# EAGLE design powerboard_v1b (EAGLE 7.2.0)
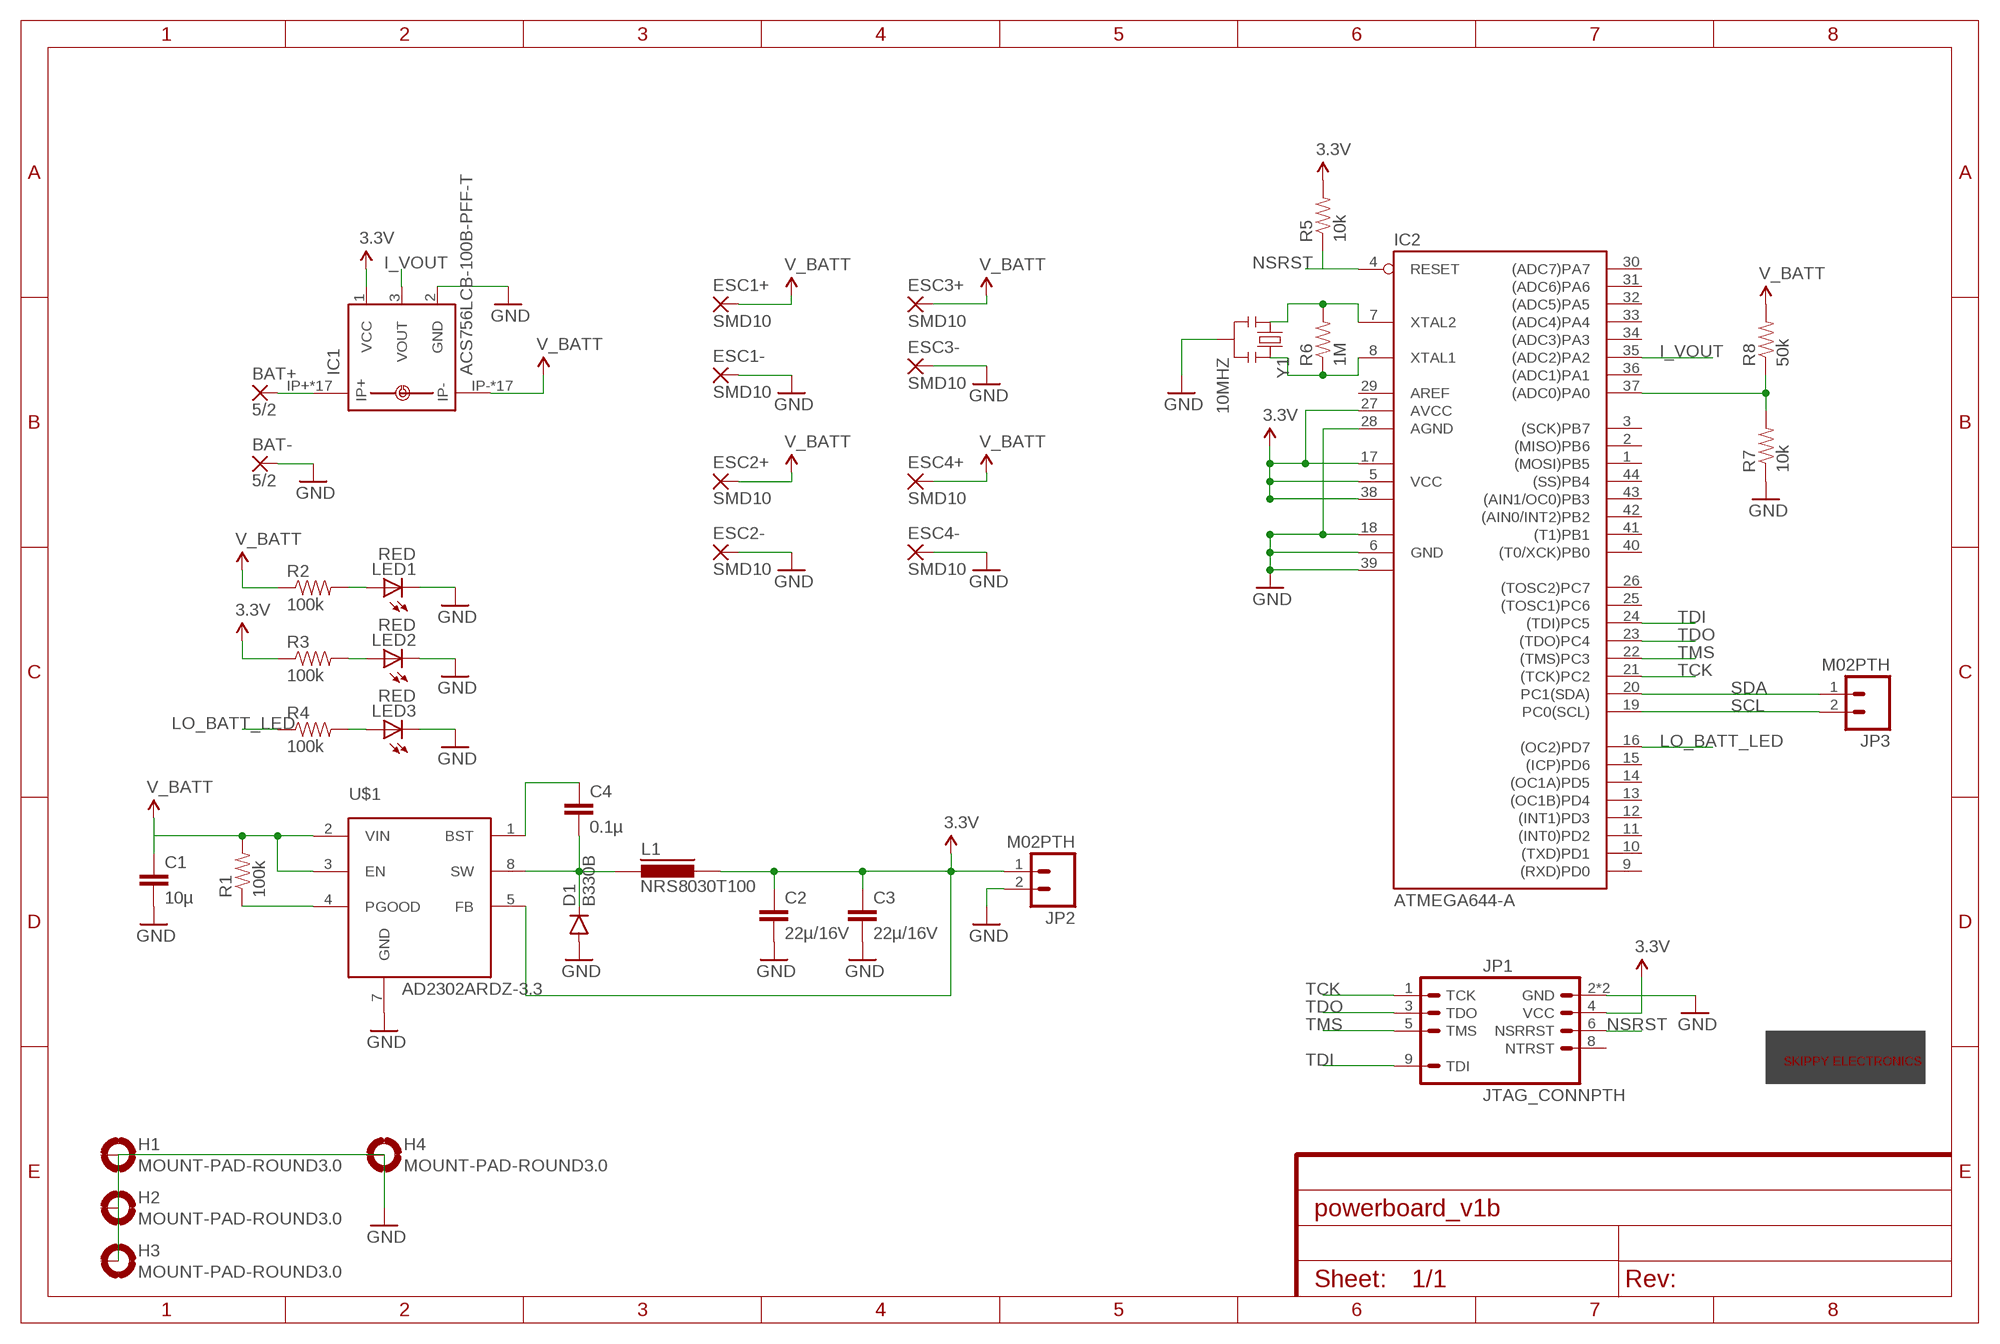
[diagram p0: schematic, sheet 1]
FRAME1 (FRAME-A4L): CNAME: SkippyElectronics; CREVISION: 1.0.0; DESIGNER: Christophe Huriaux

## Parts
BAT+  5/2  [5/2]
BAT-  5/2  [5/2]
C1  10µ  CAP1206  [1206]
C2  22µ/16V  CAP1206  [1206]
C3  22µ/16V  CAP1206  [1206]
C4  0.1µ  CAP1206  [1206]
D1  B330B  DIODESMB  [SMB-DIODE]
ESC1+  SMD10  [SMD5.08-10.16]
ESC1-  SMD10  [SMD5.08-10.16]
ESC2+  SMD10  [SMD5.08-10.16]
ESC2-  SMD10  [SMD5.08-10.16]
ESC3+  SMD10  [SMD5.08-10.16]
ESC3-  SMD10  [SMD5.08-10.16]
ESC4+  SMD10  [SMD5.08-10.16]
ESC4-  SMD10  [SMD5.08-10.16]
H1  MOUNT-PAD-ROUND3.0  [3,0-PAD]
H2  MOUNT-PAD-ROUND3.0  [3,0-PAD]
H3  MOUNT-PAD-ROUND3.0  [3,0-PAD]
H4  MOUNT-PAD-ROUND3.0  [3,0-PAD]
IC1  ACS756LCB-100B-PFF-T  [CB-PFF]
IC2  ATMEGA644-A  [TQFP44]
JP1  JTAG_CONNPTH  [AVR_ICSP]
JP2  M02PTH  [1X02]
JP3  M02PTH  [1X02]
L1  NRS8030T100  [NRS8030]
LED1  RED  LED_E  [LED_1206]
LED2  RED  LED_E  [LED_1206]
LED3  RED  LED_E  [LED_1206]
R1  100k  RESISTOR1206  [1206]
R2  100k  RESISTOR1206  [1206]
R3  100k  RESISTOR1206  [1206]
R4  100k  RESISTOR1206  [1206]
R5  10k  RESISTOR1206  [1206]
R6  1M  RESISTOR1206  [1206]
R7  10k  RESISTOR1206  [1206]
R8  50k  RESISTOR1206  [1206]
U$1  AD2302ARDZ-3.3  [SO8]
U$2  SKIPPYTXT-PLC-10MM  [SKIPPYTXT-PLC-10MM]
Y1  10MHZ  RESONATOR8MHZ  [RESONATOR-SMD]

## Nets
3.3V: C2.1 C3.1 IC1.1(VCC) IC2.5(VCC) IC2.17(VCC1) IC2.27(AVCC) IC2.38(VCC2) JP1.4(VCC) JP2.1 L1.P$2 R3.1 R5.2 U$1.5(FB)
GND: BAT-.P$1(P) C1.2 C2.2 C3.2 D1.A ESC1-.P$1(P) ESC1-.P$2(P) ESC2-.P$1(P) ESC2-.P$2(P) ESC3-.P$1(P) ESC3-.P$2(P) ESC4-.P$1(P) ESC4-.P$2(P) IC1.2(GND) IC2.6(GND) IC2.18(GND1) IC2.28(AGND) IC2.39(GND2) JP1.2(GND) JP1.10(GND) JP2.2 LED1.C LED2.C LED3.C R7.1 U$1.7(GND) Y1.2
I_VOUT: IC1.3(VOUT) IC2.35((ADC2)PA2)
LO_BATT_LED: IC2.16((OC2)PD7) R4.1
N$1: BAT+.P$1(P) IC1.IP+ IC1.IP+@2(IP+) IC1.IP+@3(IP+) IC1.IP+@4(IP+) IC1.IP+@5(IP+) IC1.IP+@6(IP+) IC1.IP+@7(IP+) IC1.IP+@8(IP+) IC1.IP+@9(IP+) IC1.IP+@10(IP+) IC1.IP+@11(IP+) IC1.IP+@12(IP+) IC1.IP+@13(IP+) IC1.IP+@14(IP+) IC1.IP+@15(IP+) IC1.IP+@16(IP+) IC1.IP+@17(IP+)
N$2: C4.2 D1.C L1.P$1 U$1.8(SW)
N$3: R1.1 U$1.4(PGOOD)
N$4: LED1.A R2.2
N$5: C4.1 U$1.1(BST)
N$6: LED2.A R3.2
N$7: LED3.A R4.2
N$8: IC2.7(XTAL2) R6.2 Y1.1
N$9: IC2.8(XTAL1) R6.1 Y1.3
N$10: IC2.37((ADC0)PA0) R7.2 R8.1
NSRST: IC2.4(RESET) JP1.6(NSRRST) R5.1
SCL: IC2.19(PC0(SCL)) JP3.2
SDA: IC2.20(PC1(SDA)) JP3.1
TCK: IC2.21((TCK)PC2) JP1.1(TCK)
TDI: IC2.24((TDI)PC5) JP1.9(TDI)
TDO: IC2.23((TDO)PC4) JP1.3(TDO)
TMS: IC2.22((TMS)PC3) JP1.5(TMS)
V_BATT: C1.1 ESC1+.P$1(P) ESC1+.P$2(P) ESC2+.P$1(P) ESC2+.P$2(P) ESC3+.P$1(P) ESC3+.P$2(P) ESC4+.P$1(P) ESC4+.P$2(P) IC1.IP- IC1.IP-@2(IP-) IC1.IP-@3(IP-) IC1.IP-@4(IP-) IC1.IP-@5(IP-) IC1.IP-@6(IP-) IC1.IP-@7(IP-) IC1.IP-@8(IP-) IC1.IP-@9(IP-) IC1.IP-@10(IP-) IC1.IP-@11(IP-) IC1.IP-@12(IP-) IC1.IP-@13(IP-) IC1.IP-@14(IP-) IC1.IP-@15(IP-) IC1.IP-@16(IP-) IC1.IP-@17(IP-) R1.2 R2.1 R8.2 U$1.2(VIN) U$1.3(EN)
Unconnected: H1.B3,0(MOUNT) H2.B3,0(MOUNT) H3.B3,0(MOUNT) H4.B3,0(MOUNT) IC2.1((MOSI)PB5) IC2.2((MISO)PB6) IC2.3((SCK)PB7) IC2.9((RXD)PD0) IC2.10((TXD)PD1) IC2.11((INT0)PD2) IC2.12((INT1)PD3) IC2.13((OC1B)PD4) IC2.14((OC1A)PD5) IC2.15((ICP)PD6) IC2.25((TOSC1)PC6) IC2.26((TOSC2)PC7) IC2.29(AREF) IC2.30((ADC7)PA7) IC2.31((ADC6)PA6) IC2.32((ADC5)PA5) IC2.33((ADC4)PA4) IC2.34((ADC3)PA3) IC2.36((ADC1)PA1) IC2.40((T0/XCK)PB0) IC2.41((T1)PB1) IC2.42((AIN0/INT2)PB2) IC2.43((AIN1/OC0)PB3) IC2.44((SS)PB4) JP1.8(NTRST)

## Library data of the parts
BAT+ BAT- = connectors:5/2
C1-C4 = SparkFun-Capacitors:CAP: Capacitor Standard 0603 ceramic capacitor, and 0.1" leaded capacitor.
D1 = SparkFun-DiscreteSemi:DIODE: Diode These are standard reverse protection diodes and small signal diodes. SMA package can handle up to about 1A. SOD-323 can handle about 200mA. What the SOD-323 package when ordering, there are some mfgs out there that are 5-pin packages.; PROD_ID: DIO-09646
ESC1+ ESC1- ESC2+ ESC2- ESC3+ ESC3- ESC4+ ESC4- = connectors:SMD10: SMD PAD
H1-H4 = holes:MOUNT-PAD-ROUND: MOUNTING PAD, round
IC1 = allegro:ACS756: Thermally Enhanced, Fully Integrated, Hall Effect-Based Linear Current Sensor with 100 micro Ohm Current Conductor display layer 49 Reference in BRD and place VIAs on circles Source: http://www.allegromicro.com/en/Products/Part_Numbers/0758/0758.pdf; MPN: ACS758LCB-100B-PFF-T; OC_FARNELL: 1718998; OC_NEWARK: 04R7132
IC2 = atmega:ATMEGA644: MICROCONTROLLER 32 Kbytes FLASH 2 Kbytes SRAM 1 Kbytes EEPROM USART 8-channel 10 bit ADC Source: avr.lbr; OC_FARNELL: unknown; OC_NEWARK: unknown
JP1 = connectors:JTAG_CONN: Header 5x2 Standard 10-pin dual row 0.1" header. Commonly used with AVR-ISP. Use with Spark Fun Electronics SKU: PRT-00778
JP2 JP3 = SparkFun-Connectors:M02: Standard 2-pin 0.1" header. Use with - straight break away headers ( PRT-00116) - right angle break away headers (PRT-00553) - swiss pins (PRT-00743) - machine pins (PRT-00117) - female headers (PRT-00115) Molex polarized connector foot print use with: PRT-08233 with associated crimp pins and housings. 2.54_SCREWTERM for use with PRT-10571. 3.5mm Screw Terminal footprints for PRT-08084 5mm Screw Terminal footprints for use with PRT-08432
L1 = inductors:NRS8030T100
LED1-LED3 = eagle-ltspice:LED_E: LED Source: http://www.osram.convergy.de Source: www.luxeon.com Source: www.kingbright.com; SPICEMODEL: NONE; SPICEPREFIX: D; SPICETYPE: diode
R1-R8 = SparkFun-Passives:RESISTOR: Resistor Basic schematic elements and footprints for 0603, 1206, and PTH resistors.
U$1 = dcdcconv:AD2302ARDZ-3.3
U$2 = skippy-logo:SKIPPYTXT-PLC-10MM
Y1 = SparkFun-FreqCtrl:RESONATOR: Resonator Small SMD resonator. Used, eg, on the Arduino Pro/ Pro Mini boards. 8MHz- XTAL-08895 16MHz- XTAL-08900; PROD_ID: XTAL-08895; VALUE: 8MHZ

## Board
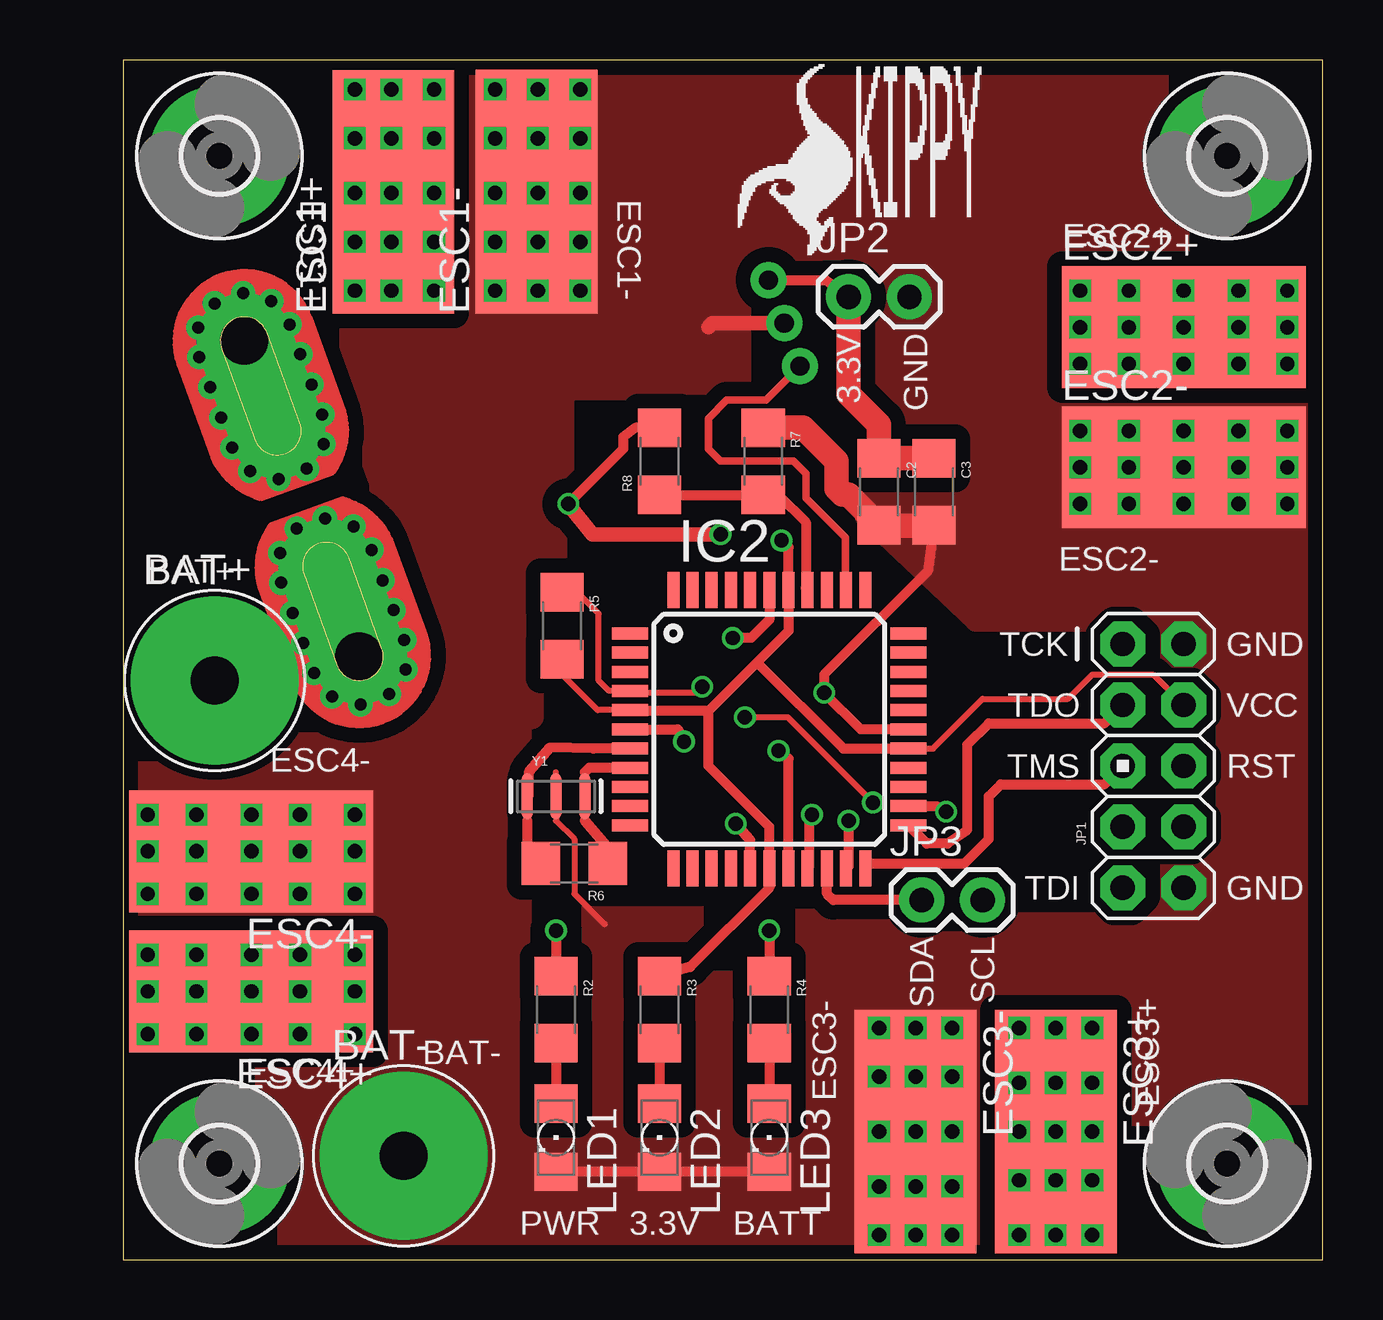
[diagram p1: board, top side]
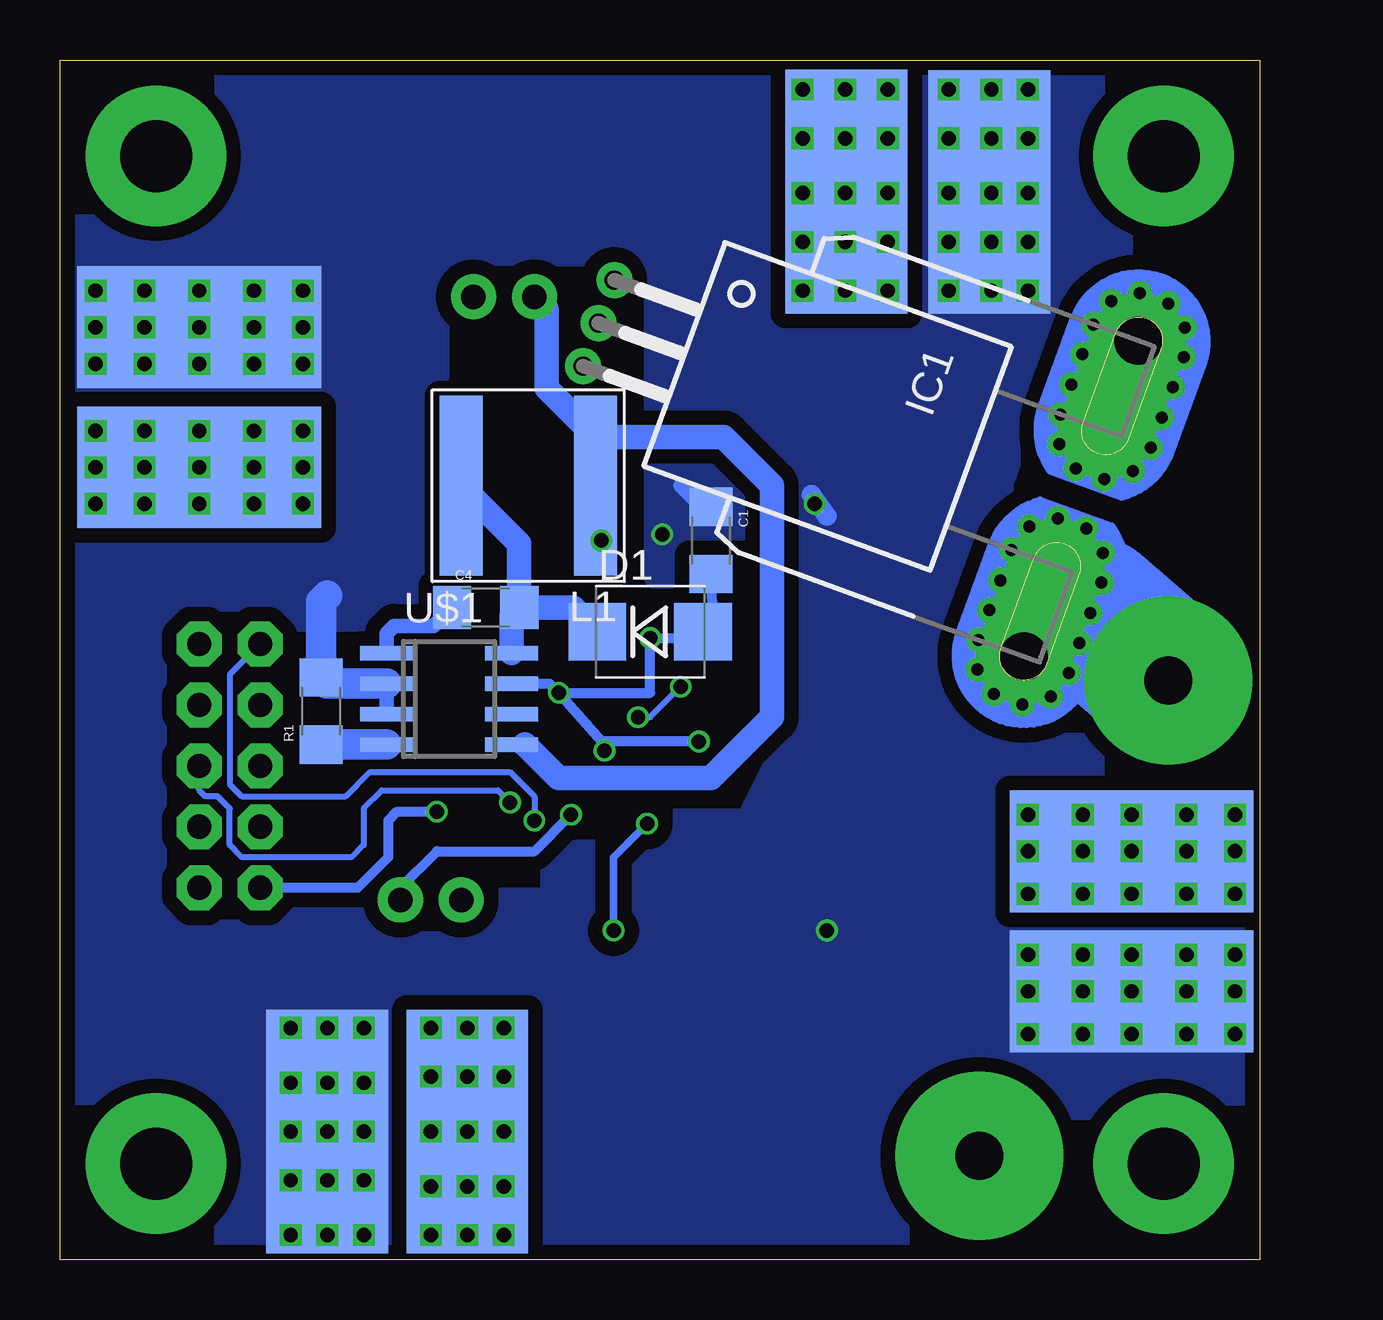
[diagram p2: board, bottom side, seen from below]

Size 50 x 50 mm. Coordinates in mm from the lower left corner, seen from the top.
Outline: 0,0 50,0 50,50 0,50 0,0
Copper layers (1*16): Top 0.035mm / dielectric 1.5mm / Bottom 0.035mm
Design rules "SeeedStudio_DRU_no_angle_20130527 *": minimum track width 6mil, minimum drill 12mil, track to track 6mil, track to pad 6mil, pad to pad 6mil, via to via 6mil, smd to smd 0mil, copper to edge 10mil, drill to drill 10mil, minimum pad ring 10mil, minimum via ring 6mil, stop-mask expansion 2mil, vias tented up to drill 100mil, thermal gap 10mil

### Footprints (pad centres in the part's own frame; a part is rotated, then mirrored left to right if it is on the bottom)
5/2 = drill 2 pad 7: P$1 0,0
1206 = smd 1.6 x 1.8: 1 -1.4,0; 2 1.4,0
SMB-DIODE = smd 2.4 x 2.4: A 2.2,0; C -2.2,0
SMD5.08-10.16 = smd 5.08 x 10.16 bottom: P$1 0,0 | smd 5.08 x 10.16: P$2 0,0
3,0-PAD = drill 3 pad 5.842: B3,0 0,0
CB-PFF = drill 0.8 pad 1.5: 1 -1.91,-21.4; 2 0,-21.4; 3 1.91,-21.4 | drill 2 pad 4 offset: IP+ 7,0; IP- -7,0 | drill 0.5 pad 0.9: IP+@2 8.89,0.635; IP+@3 8.89,-0.635; IP+@4 8.175,-1.625; IP+@5 7,-2; IP+@6 5.675,-2; IP+@7 4.35,-2; IP+@8 3,-2; IP+@9 1.825,-1.625; IP+@10 1.1,-0.625; IP+@11 1.1,0.625; IP+@12 1.825,1.625; IP+@13 3,2; IP+@14 4.35,2; IP+@15 5.675,2; IP+@16 7,2; IP+@17 8.175,1.625; IP-@2 -8.89,0.635; IP-@3 -8.89,-0.635; IP-@4 -8.175,-1.625; IP-@5 -7,-2; IP-@6 -5.675,-2; IP-@7 -4.325,-2; IP-@8 -3,-2; IP-@9 -1.825,-1.625; IP-@10 -1.1,-0.625; IP-@11 -1.1,0.625; IP-@12 -1.825,1.625; IP-@13 -3,2; IP-@14 -4.325,2; IP-@15 -5.675,2; IP-@16 -7,2; IP-@17 -8.175,1.625
TQFP44 = smd 1.5 x 0.5: 1 -5.8,4; 2 -5.8,3.2; 3 -5.8,2.4; 4 -5.8,1.6; 5 -5.8,0.8; 6 -5.8,0; 7 -5.8,-0.8; 8 -5.8,-1.6; 9 -5.8,-2.4; 10 -5.8,-3.2; 11 -5.8,-4; 23 5.8,-4; 24 5.8,-3.2; 25 5.8,-2.4; 26 5.8,-1.6; 27 5.8,-0.8; 28 5.8,0; 29 5.8,0.8; 30 5.8,1.6; 31 5.8,2.4; 32 5.8,3.2; 33 5.8,4 | smd 0.5 x 1.5: 12 -4,-5.8; 13 -3.2,-5.8; 14 -2.4,-5.8; 15 -1.6,-5.8; 16 -0.8,-5.8; 17 0,-5.8; 18 0.8,-5.8; 19 1.6,-5.8; 20 2.4,-5.8; 21 3.2,-5.8; 22 4,-5.8; 34 4,5.8; 35 3.2,5.8; 36 2.4,5.8; 37 1.6,5.8; 38 0.8,5.8; 39 0,5.8; 40 -0.8,5.8; 41 -1.6,5.8; 42 -2.4,5.8; 43 -3.2,5.8; 44 -4,5.8
AVR_ICSP = drill 1.016 pad 1.88 octagon: 1 -1.27,5.08; 2 1.27,5.08; 3 -1.27,2.54; 4 1.27,2.54; 5 -1.27,0; 6 1.27,0; 7 -1.27,-2.54; 8 1.27,-2.54; 9 -1.27,-5.08; 10 1.27,-5.08
1X02 = drill 1.016 pad 1.88: 1 0,0; 2 2.54,0
NRS8030 = smd 1.8 x 7.5: P$1 2.8,0; P$2 -2.8,0
LED_1206 = smd 1.6 x 1.803: A -1.422,0; C 1.422,0
SO8 = smd 0.6 x 2.2: 1 -1.905,-2.6; 2 -0.635,-2.6; 3 0.635,-2.6; 4 1.905,-2.6; 5 1.905,2.6; 6 0.635,2.6; 7 -0.635,2.6; 8 -1.905,2.6
RESONATOR-SMD = smd 0.45 x 1.905: 1 -1.2,0; 2 0,0; 3 1.2,0

### Placement (x,y rotation side)
BAT+  3.81,24.13 0 top
BAT-  11.68,4.32 0 top
C1  22.86,29.97 270 bottom
C2  31.5,32 270 top
C3  33.78,32 270 top
C4  32.26,27.18 0 bottom
D1  25.4,26.16 0 bottom
ESC1+  11.25,44.5 0 top
ESC1-  17.23,44.5 0 top
ESC2+  44.2,38.86 270 top
ESC2-  44.2,33.02 270 top
ESC3+  38.86,5.33 180 top
ESC3-  33.02,5.33 180 top
ESC4+  5.33,11.18 90 top
ESC4-  5.33,17.02 90 top
H1  4,46 0 top
H2  46,46 0 top
H3  4,4 0 top
H4  46,4 90 top
IC1  7.44,31.71 250 bottom
IC2  26.92,22.1 0 top
JP1  42.93,20.57 0 top
JP2  30.23,40.13 0 top
JP3  33.27,14.99 0 top
L1  30.48,32.26 180 bottom
LED1  18.03,5.08 270 top
LED2  22.35,5.08 270 top
LED3  26.92,5.08 270 top
R1  39.12,22.86 90 bottom
R2  18.03,10.41 270 top
R3  22.35,10.41 270 top
R4  26.92,10.41 270 top
R5  18.29,26.42 270 top
R6  18.8,16.51 180 top
R7  26.67,33.27 270 top
R8  22.35,33.27 90 top
U$1  33.78,23.37 270 bottom
U$2  25.65,41.91 0 top
Y1  18.03,19.3 0 top

### Tracks (layer width: path | path; a pad name or v marks a point on that pad's centre or on a via)
3.3V  (via drill 0.6)
  Top 0.254: IC2.27 33.74,21.3 35.81,23.37 39.37,23.37 40.39,24.38 42.93,24.38 JP1.4 | IC2.5 19.77,22.9 18.29,24.38 R5.2
  Top 0.406: 26.42,24.89 27.72,26.2 IC2.38 27.72,29.68 v27.43,29.97 | 26.42,24.89 24.38,22.86 | 24.38,22.86 21.16,22.86 IC2.5 | 26.42,24.89 30.01,21.3 IC2.27 | R3.1 23.62,12.19 26.92,15.49 IC2.17 26.92,18.03 24.38,20.57 24.38,22.86 | IC1.1 29.28,40.83 JP2.1
  Top 1.016: C3.1 C2.1 31.5,34.8 30.23,36.07 JP2.1
  Bottom 0.406: v27.43,29.97 27.18,30.48 27.69,30.99 L1.P$2 | U$1.5 30.64,21.46
  Bottom 1.016: L1.P$2 27.68,34.04 | 27.68,34.04 27.68,34.28 29.72,36.32 29.72,39.62 JP2.1 | 30.64,21.46 30.61,21.46 29.21,20.07 22.86,20.07 20.32,22.61 20.32,32.26 22.35,34.29 27.43,34.29 27.68,34.04
GND  (via drill 0.6)
  Top 0.254: Y1.2 18.03,18.29 18.8,17.53 18.8,15.24 20.07,13.97
  Top 0.305: ESC1-.P$2 17.23,45.42 17.27,45.47 16.76,45.47 16.51,45.21 | ESC1-.P$2 17.22,44.5 16.51,45.21 | 16.51,44.96 16.51,45.21 | v19.05,44.45 18.29,43.69 18.29,43.43 v17.27,44.45 ESC1-.P$2 | ESC1-.P$2 17.58,44.5 18.03,44.96 18.03,43.69 | ESC1-.P$2 17.23,44.15 v15.49,42.42
  Top 0.406: IC2.39 26.92,26.67 26.16,25.91 v25.4,25.91 | IC2.28 30.73,22.1 v29.21,23.62 29.21,24.38 33.53,28.7 C3.2 | IC2.18 27.72,20.87 v27.3,21.21 | LED3.C LED2.C LED1.C | IC2.6 23.11,22.1 v23.37,21.59 | ESC2-.P$2 43.18,33.02
  Top 0.61: IC1.2 24.56,39.03 24.38,38.86
  Top 1.016: C3.2 C2.2 30.22,31.88 29.97,31.88 29.72,32.13 29.72,33.27 28.32,34.67 R7.1
  Bottom 0.305: ESC1-.P$2 17.23,44.91 v19.05,46.74
  Bottom 0.406: v29.21,23.62 25.4,23.62 v25.4,25.91 23.45,25.91 D1.A 22.82,27.18 C1.2 | v27.3,21.21 27.43,21.59 | 27.43,21.59 v29.21,23.62 | v23.37,21.59 27.43,21.59 | U$1.7 29.59,24 v29.21,23.62
  other vias: 15.49,48.77 19.05,48.77 17.27,48.77 17.27,46.74 15.49,46.74 15.49,44.45 19.05,42.42 17.27,42.42 15.49,40.39 17.27,40.39 19.05,40.39 39.88,34.54 39.88,31.5 39.88,33.02 41.91,33.02 41.91,34.54 44.2,34.54 44.2,33.02 41.91,31.5 44.2,31.5 46.48,31.5 48.51,31.5 48.51,33.02 46.48,33.02 46.48,34.54 48.51,34.54 31.5,9.65 33.02,9.65 34.54,9.65 34.54,7.62 33.02,7.62 31.5,7.62 31.5,5.33 33.02,5.33 34.54,5.33 34.54,3.05 34.54,1.02 33.02,1.02 33.02,3.05 31.5,3.05 31.5,1.02 1.02,18.54 1.02,17.02 1.02,15.24 3.05,15.24 3.05,17.02 3.05,18.54 5.33,18.54 5.33,17.02 5.33,15.24 7.37,15.24 7.37,17.02 7.37,18.54 9.65,18.54 9.65,17.02 9.65,15.24
  pour Top (isolate 0.61, no thermals): 0,49.78 49.78,49.78 49.78,0.25 0.25,0.25 0.25,40.89 7.62,40.89 9.65,36.07 18.29,36.07 18.29,29.72 17.02,29.72 17.02,22.61 16.51,22.61 16.51,14.22 29.97,14.22 29.97,13.97 42.93,13.97 42.93,26.67 35.56,26.67 30.99,30.99 30.99,41.4 25.65,41.4 25.65,36.32 9.91,36.32 7.87,41.15 0.25,41.15
I_VOUT
  Top 0.305: IC2.35 30.1,27.92 30.1,30.1 28.45,31.75 28.45,32.77 27.94,33.27 24.89,33.27 24.38,33.78 24.38,35.05 25.15,35.81 26.78,35.81 IC1.3
LO_BATT_LED  (via drill 0.6)
  Top 0.406: IC2.16 26.12,17.49 v25.53,18.16 | v26.92,13.72 R4.1
  Bottom 0.305: v25.53,18.16 26.92,16.76 v26.92,13.72
N$1
  Bottom 6.452: BAT+.P$1 IC1.IP+@14
N$2
  Bottom 1.016: U$1.8 31.18,26.85 C4.2 | C4.2 30.86,29.84 L1.P$1 | C4.2 28.62,27.18 D1.C
N$3
  Bottom 1.27: U$1.4 R1.1
N$4
  Top 0.406: R2.2 LED1.A
N$5
  Bottom 0.61: U$1.1 36.38,26.1 36.07,26.42 34.42,26.42 C4.1
N$6
  Top 0.406: R3.2 LED2.A
N$7
  Top 0.406: R4.2 LED3.A
N$8
  Top 0.406: IC2.7 19.6,21.3 17.78,21.34 16.89,20.32 16.89,19.36 Y1.1 | 16.83,18.29 16.83,17.22 R6.2
N$9
  Top 0.406: IC2.8 19.41,20.5 19.23,20.32 | 19.23,18.29 20.5,16.82 R6.1
N$10
  Top 0.406: R8.1 R7.2 27.31,31.87 28.45,30.73 28.45,27.97 IC2.37
NSRST  (via drill 0.6)
  Top 0.254: R5.1 18.42,27.69 19.05,27.69 19.81,26.92 19.81,24.13 20.24,23.7 IC2.4 21.2,23.62 23.88,23.62 v24.13,23.88 | v25.91,22.61 27.69,22.61 v31.24,19.05
  Bottom 0.254: v25.91,22.61 25.4,22.61 v24.13,23.88 | JP1.6 44.2,19.56 43.94,19.3 43.43,19.3 42.93,18.8 42.93,17.27 42.42,16.76 37.85,16.76 37.34,17.27 37.34,18.8 36.58,19.56 31.75,19.56 v31.24,19.05
SCL  (via drill 0.6)
  Top 0.406: 28.57,16.25 IC2.19 28.57,16.35 28.57,18.41 v28.7,18.54
  Bottom 0.406: JP3.2 35.81,15.49 34.29,17.02 30.23,17.02 v28.7,18.54
SDA
  Top 0.406: JP3.1 29.59,14.99 29.34,15.24 29.34,16.29 IC2.20
TCK  (via drill 0.6)
  Top 0.406: v30.23,18.29 30.23,16.4 IC2.21
  Bottom 0.254: JP1.1 42.93,24.38 42.93,19.81 42.42,19.3 38.1,19.3 37.08,20.32 31.24,20.32 30.23,19.3 v30.23,18.29
TDI  (via drill 0.6)
  Top 0.406: IC2.24 33.88,18.9 v34.29,18.67
  Bottom 0.406: v34.29,18.67 35.94,18.67 36.32,18.29 36.32,16.76 37.59,15.49 JP1.9
TDO
  Top 0.406: JP1.3 40.89,22.35 36.07,22.35 35.18,21.46 35.18,17.91 34.35,17.34 33.49,17.34 IC2.23
TMS
  Top 0.406: IC2.22 30.99,16.36 30.99,16.51 35.05,16.51 36.07,17.53 36.07,19.3 36.58,19.81 40.89,19.81 JP1.5
V_BATT  (via drill 0.6)
  Top 0.305: v12.95,44.45 v11.18,44.45 v11.18,46.74 | ESC1+.P$2 11.25,46.66 v11.18,46.74 | v11.18,46.74 11.18,46.23 v12.95,44.45 | v12.95,44.45 12.7,44.45 11.68,43.43 10.67,43.43 v9.65,42.42
  Top 0.406: R8.2 21.34,34.67 20.83,34.29 20.83,33.78 v18.54,31.5 | v18.03,13.72 R2.1
  Top 0.61: v24.89,30.23 19.56,30.23 v18.54,31.5
  Bottom 0.305: v11.18,46.74 v12.95,46.74 v12.95,44.45 v11.18,44.45 v11.18,46.74 | v11.18,46.74 10.41,46.74 9.14,45.47
  Bottom 0.406: ESC1+.P$2 9.45,44.5 | v37.34,9.65 37.08,9.65 | v18.54,31.5 18.67,31.88
  Bottom 0.61: U$1.3 U$1.2 | C1.1 23.24,31.37 24.13,32.26
  Bottom 0.813: 18.67,31.88 18.03,30.99
  Bottom 1.27: U$1.2 38.86,24 R1.2 39.12,27.43 38.86,27.69
  other vias: 38.86,5.33 40.39,9.65 40.39,1.02 37.34,1.02 40.39,7.37 37.34,7.37 40.39,5.33 40.39,3.3 37.34,3.3 37.34,5.33 38.86,7.37 38.86,9.65 38.86,3.3 38.86,1.02 9.65,12.7 9.65,9.4 9.65,11.18 5.33,12.7 5.33,11.18 5.33,9.4 7.37,9.4 7.37,11.18 7.37,12.7 1.02,12.7 1.02,9.4 1.02,11.18 3.05,11.18 3.05,9.4 3.05,12.7 39.88,40.39 39.88,37.34 39.88,38.86 41.91,38.86 41.91,40.39 41.91,37.34 44.2,37.34 44.2,38.86 44.2,40.39 46.48,40.39 46.48,38.86 46.48,37.34 48.51,37.34 48.51,38.86 48.51,40.39 9.65,48.77 11.18,48.77 12.95,48.77 9.65,46.74 9.65,44.45 12.95,42.42 11.18,42.42 11.18,40.39 12.95,40.39 9.65,40.39
  pour Bottom (isolate 0.61, no thermals): 0.25,49.78 49.78,49.78 49.78,0.25 0.25,0.25 0.25,41.15 8.38,41.15 8.38,28.19 19.56,28.19 19.56,21.84 21.34,18.29 29.46,18.29 29.46,14.99 44.96,14.99 44.96,26.67 35.31,26.67 35.31,36.07 34.29,36.83 34.29,41.91 25.15,41.91 25.15,28.45 8.64,28.45 8.64,41.4 0.25,41.4

### Text on the board
tPlace: ESC1+ | ESC1- | ESC2+ | 3.3V | GND | ESC2- | BAT+ | TCK | GND | TDO | VCC | TMS | ESC4- | RST | TDI | GND | SDA | SCL | BAT- | ESC4+ | ESC3- | ESC3+ | PWR | 3.3V | BATT